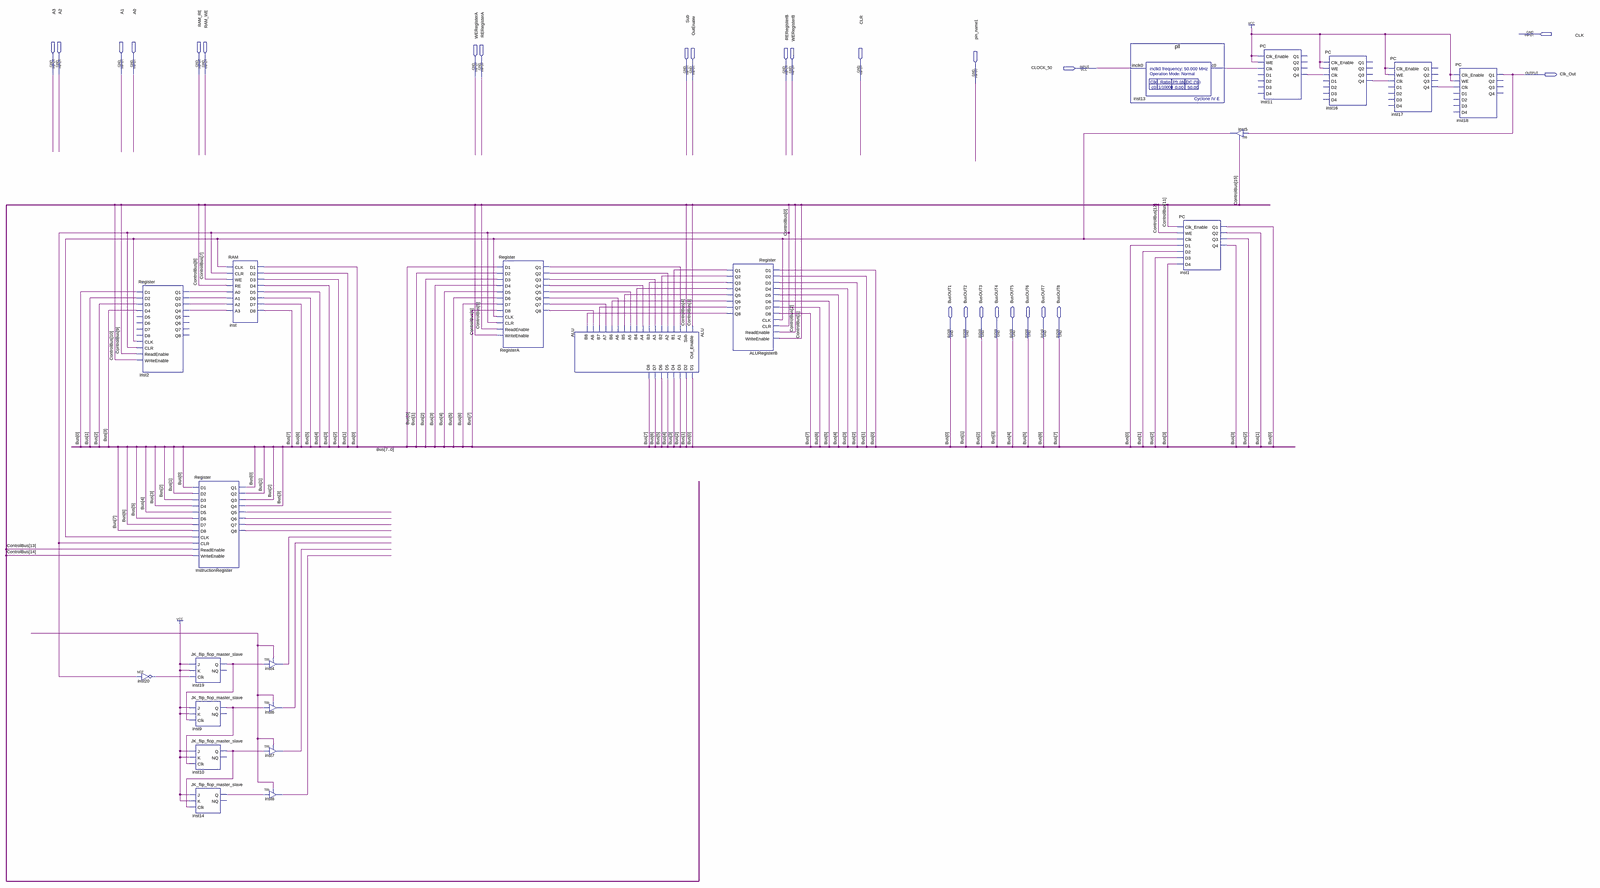
[diagram p0: schematic sheet, whole]
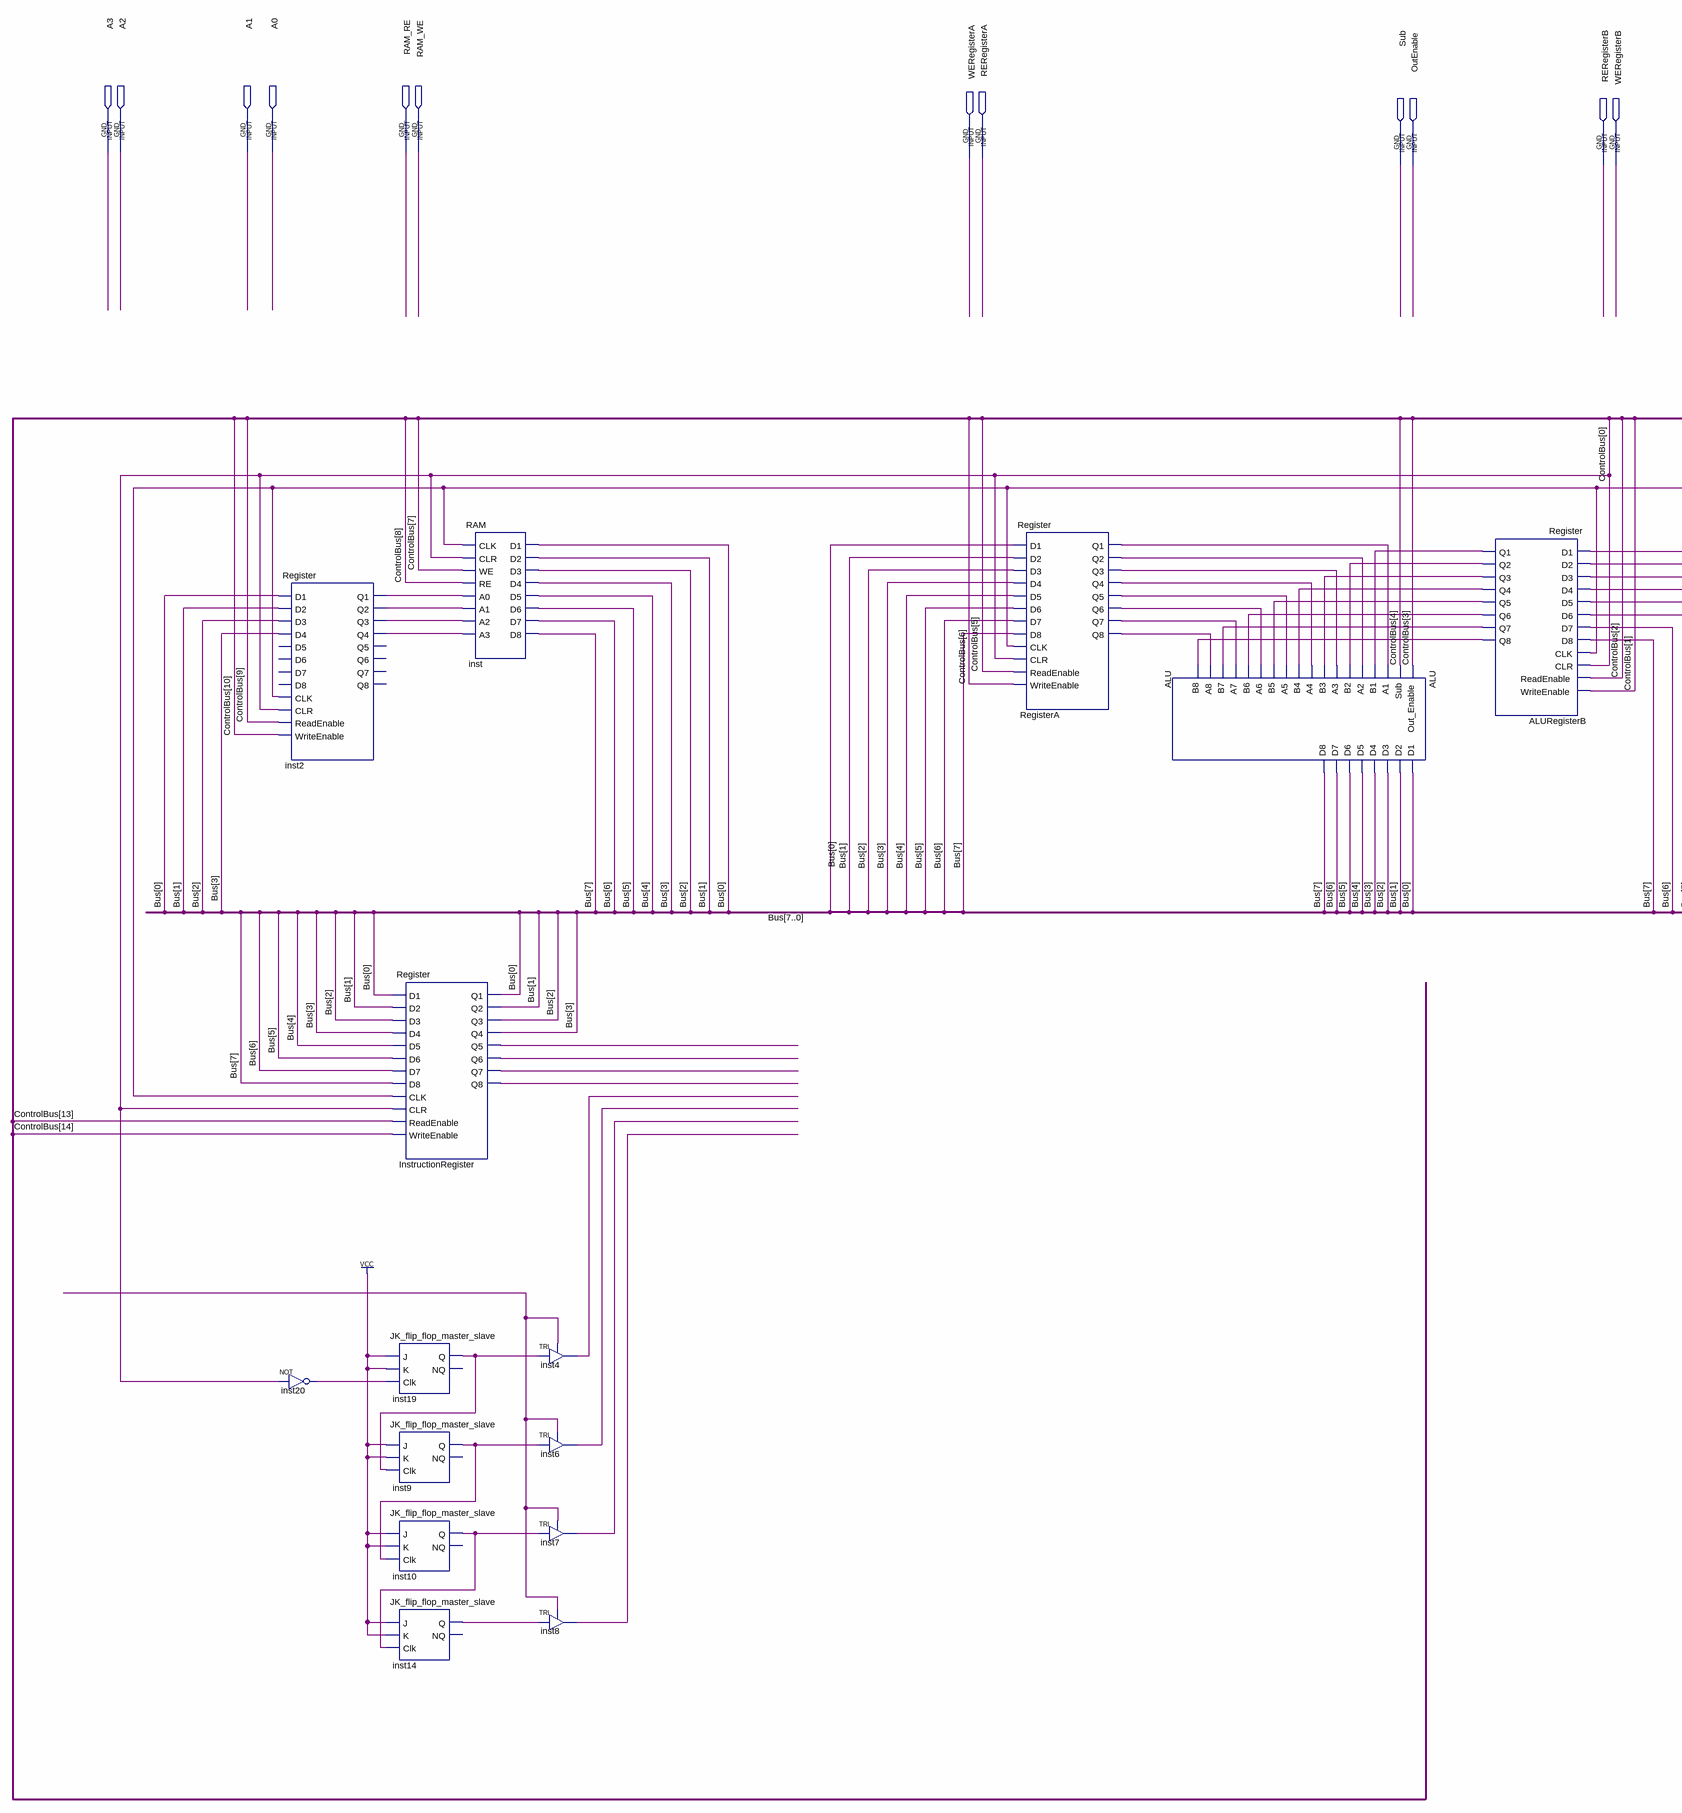
[diagram p1: schematic sheet, left part]
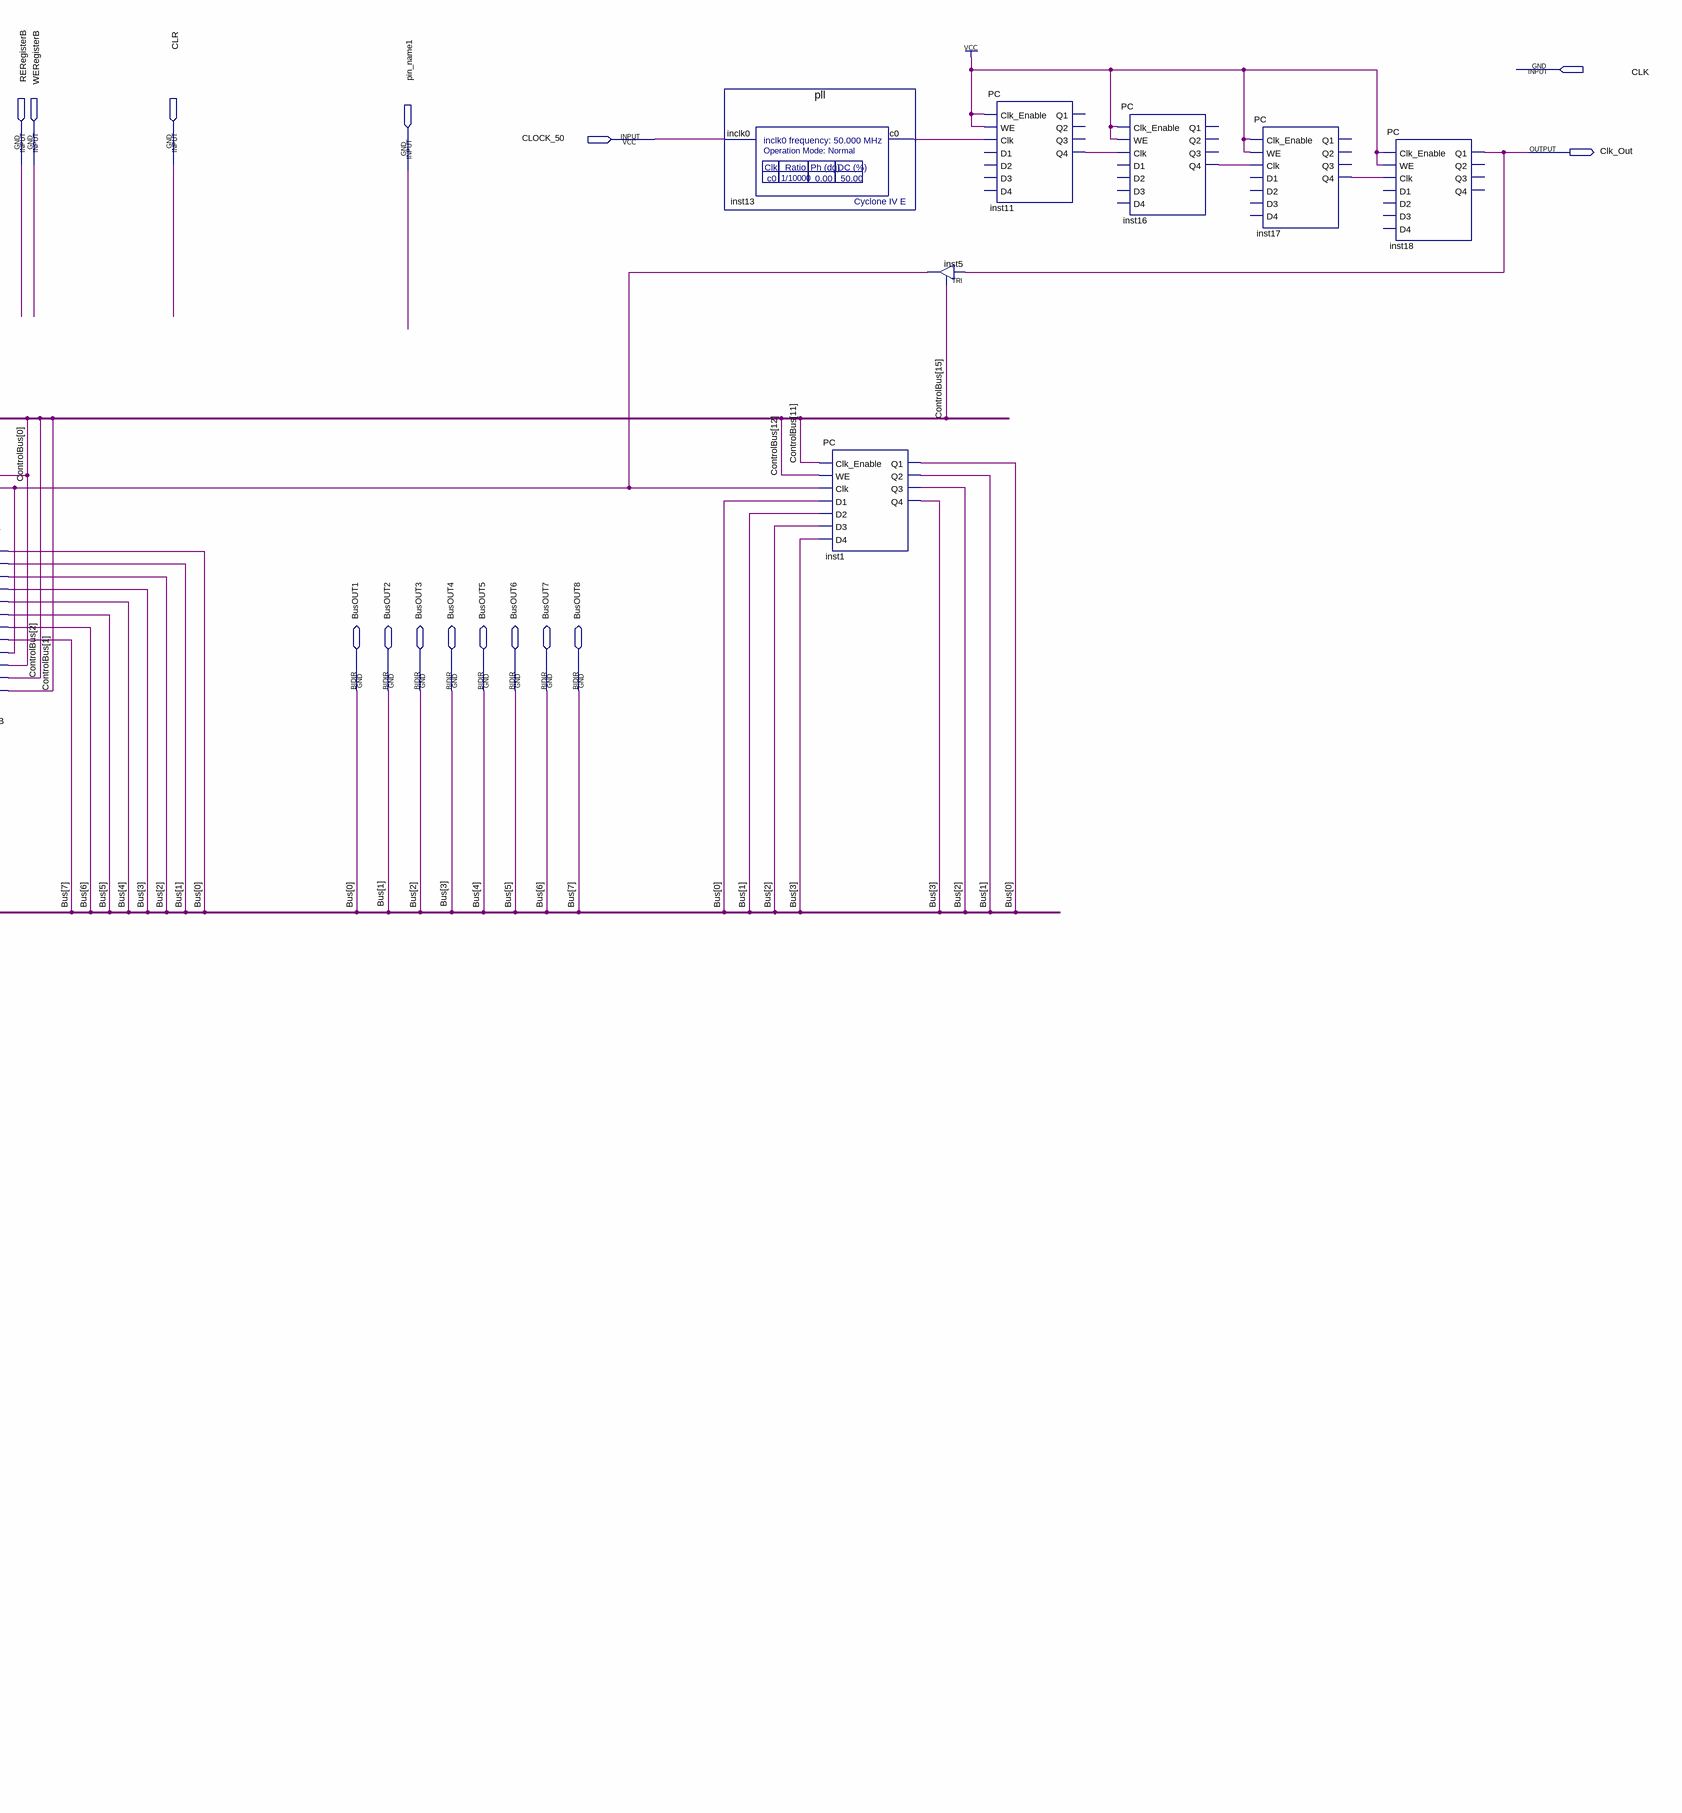
[diagram p2: schematic sheet, right part]
// Quartus schematic 8bitComputer.bdf as structural Verilog: 22 symbols, 25 pins
module \8bitComputer  (
  input  CLK,
  input  CLOCK_50,
  input  A3,
  input  A2,
  input  A1,
  input  A0,
  input  RAM_RE,
  input  RAM_WE,
  input  WERegisterA,
  input  RERegisterA,
  input  Sub,
  input  OutEnable,
  input  RERegisterB,
  input  WERegisterB,
  input  CLR,
  input  pin_name1,
  inout  BusOUT1,
  inout  BusOUT2,
  inout  BusOUT3,
  inout  BusOUT4,
  inout  BusOUT5,
  inout  BusOUT6,
  inout  BusOUT7,
  inout  BusOUT8,
  output Clk_Out
);

  wire ALURegisterB_q1, ALURegisterB_q2, ALURegisterB_q3, ALURegisterB_q4, ALURegisterB_q5, ALURegisterB_q6,
       ALURegisterB_q7, ALURegisterB_q8, inst2_q1, inst2_q2, inst2_q3, inst2_q4, inst4_out, inst5_out,
       inst6_out, inst7_out, inst8_out, inst9_q, inst10_q, inst11_q4, inst13_c0, inst14_q, inst16_q4,
       inst17_q4, inst19_q, inst20_out, InstructionRegister_q5, InstructionRegister_q6,
       InstructionRegister_q7, InstructionRegister_q8, RegisterA_q1, RegisterA_q2, RegisterA_q3,
       RegisterA_q4, RegisterA_q5, RegisterA_q6, RegisterA_q7, RegisterA_q8, undriven;
  wire [15:0] ControlBus;

  Register inst2 (
    .D1(BusOUT1), .D2(BusOUT2), .D3(BusOUT3), .D4(BusOUT4), .CLK(inst5_out), .CLR(ControlBus[0]),
    .ReadEnable(ControlBus[9]), .WriteEnable(ControlBus[10]), .Q1(inst2_q1), .Q2(inst2_q2), .Q3(inst2_q3),
    .Q4(inst2_q4));  // open: D5, D6, D7, D8, Q5, Q6, Q7, Q8
  not inst20 (inst20_out, ControlBus[0]);
  Register InstructionRegister (
    .D1(BusOUT1), .D2(BusOUT2), .D3(BusOUT3), .D4(BusOUT4), .D5(BusOUT5), .D6(BusOUT6), .D7(BusOUT7),
    .D8(BusOUT8), .CLK(inst5_out), .CLR(ControlBus[0]), .ReadEnable(ControlBus[13]),
    .WriteEnable(ControlBus[14]), .Q1(BusOUT1), .Q2(BusOUT2), .Q3(BusOUT3), .Q4(BusOUT4),
    .Q5(InstructionRegister_q5), .Q6(InstructionRegister_q6), .Q7(InstructionRegister_q7),
    .Q8(InstructionRegister_q8));
  JK_flip_flop_master_slave inst19 (.J(1'b1), .K(1'b1), .Clk(inst20_out), .Q(inst19_q));  // open: NQ
  JK_flip_flop_master_slave inst9 (.J(1'b1), .K(1'b1), .Clk(inst19_q), .Q(inst9_q));  // open: NQ
  JK_flip_flop_master_slave inst10 (.J(1'b1), .K(1'b1), .Clk(inst9_q), .Q(inst10_q));  // open: NQ
  JK_flip_flop_master_slave inst14 (.J(1'b1), .K(1'b1), .Clk(inst10_q), .Q(inst14_q));  // open: NQ
  RAM inst (
    .CLK(inst5_out), .CLR(ControlBus[0]), .WE(ControlBus[7]), .RE(ControlBus[8]), .A0(inst2_q1),
    .A1(inst2_q2), .A2(inst2_q3), .A3(inst2_q4), .D1(BusOUT1), .D2(BusOUT2), .D3(BusOUT3), .D4(BusOUT4),
    .D5(BusOUT5), .D6(BusOUT6), .D7(BusOUT7), .D8(BusOUT8));
  TRI inst4 (.IN(inst19_q), .OE(undriven), .OUT(inst4_out));
  TRI inst6 (.IN(inst9_q), .OE(undriven), .OUT(inst6_out));
  TRI inst7 (.IN(inst10_q), .OE(undriven), .OUT(inst7_out));
  TRI inst8 (.IN(inst14_q), .OE(undriven), .OUT(inst8_out));
  Register RegisterA (
    .D1(BusOUT1), .D2(BusOUT2), .D3(BusOUT3), .D4(BusOUT4), .D5(BusOUT5), .D6(BusOUT6), .D7(BusOUT7),
    .D8(BusOUT8), .CLK(inst5_out), .CLR(ControlBus[0]), .ReadEnable(ControlBus[5]),
    .WriteEnable(ControlBus[6]), .Q1(RegisterA_q1), .Q2(RegisterA_q2), .Q3(RegisterA_q3), .Q4(RegisterA_q4),
    .Q5(RegisterA_q5), .Q6(RegisterA_q6), .Q7(RegisterA_q7), .Q8(RegisterA_q8));
  ALU ALU (
    .Out_Enable(ControlBus[3]), .Sub(ControlBus[4]), .A1(RegisterA_q1), .B1(ALURegisterB_q1),
    .A2(RegisterA_q2), .B2(ALURegisterB_q2), .A3(RegisterA_q3), .B3(ALURegisterB_q3), .A4(RegisterA_q4),
    .B4(ALURegisterB_q4), .A5(RegisterA_q5), .B5(ALURegisterB_q5), .A6(RegisterA_q6), .B6(ALURegisterB_q6),
    .A7(RegisterA_q7), .B7(ALURegisterB_q7), .A8(RegisterA_q8), .B8(ALURegisterB_q8), .D1(BusOUT1),
    .D2(BusOUT2), .D3(BusOUT3), .D4(BusOUT4), .D5(BusOUT5), .D6(BusOUT6), .D7(BusOUT7), .D8(BusOUT8));
  Register ALURegisterB (
    .D1(BusOUT1), .D2(BusOUT2), .D3(BusOUT3), .D4(BusOUT4), .D5(BusOUT5), .D6(BusOUT6), .D7(BusOUT7),
    .D8(BusOUT8), .CLK(inst5_out), .CLR(ControlBus[0]), .ReadEnable(ControlBus[2]),
    .WriteEnable(ControlBus[1]), .Q1(ALURegisterB_q1), .Q2(ALURegisterB_q2), .Q3(ALURegisterB_q3),
    .Q4(ALURegisterB_q4), .Q5(ALURegisterB_q5), .Q6(ALURegisterB_q6), .Q7(ALURegisterB_q7),
    .Q8(ALURegisterB_q8));
  pll inst13 (.inclk0(CLOCK_50), .c0(inst13_c0));
  PC inst1 (
    .Clk_Enable(ControlBus[11]), .WE(ControlBus[12]), .Clk(inst5_out), .D1(BusOUT1), .D2(BusOUT2),
    .D3(BusOUT3), .D4(BusOUT4), .Q1(BusOUT1), .Q2(BusOUT2), .Q3(BusOUT3), .Q4(BusOUT4));
  TRI inst5 (.IN(Clk_Out), .OE(ControlBus[15]), .OUT(inst5_out));
  PC inst11 (.Clk_Enable(1'b1), .WE(1'b1), .Clk(inst13_c0), .Q4(inst11_q4));  // open: D1, D2, D3, D4, Q1, Q2, Q3
  PC inst16 (.Clk_Enable(1'b1), .WE(1'b1), .Clk(inst11_q4), .Q4(inst16_q4));  // open: D1, D2, D3, D4, Q1, Q2, Q3
  PC inst17 (.Clk_Enable(1'b1), .WE(1'b1), .Clk(inst16_q4), .Q4(inst17_q4));  // open: D1, D2, D3, D4, Q1, Q2, Q3
  PC inst18 (.Clk_Enable(1'b1), .WE(1'b1), .Clk(inst17_q4), .Q1(Clk_Out));  // open: D1, D2, D3, D4, Q2, Q3, Q4

  // Other names for the same wires on the sheet: Bus[7:0] = {BusOUT8, BusOUT7, BusOUT6, BusOUT5, BusOUT4, BusOUT3, BusOUT2, BusOUT1}
endmodule
